# Altium schematic sheet Aixcel_Tiny_Recon_Board_Diagram.SchDoc
size A4; Organization: Altium Limited; Address1: L3, 12a Rodborough Rd; Address2: Frenchs Forest; Address3: NSW; Address4: Australia 2086; DocumentNumber: 01; Revision: 01; SheetNumber: 2; SheetTotal: 4
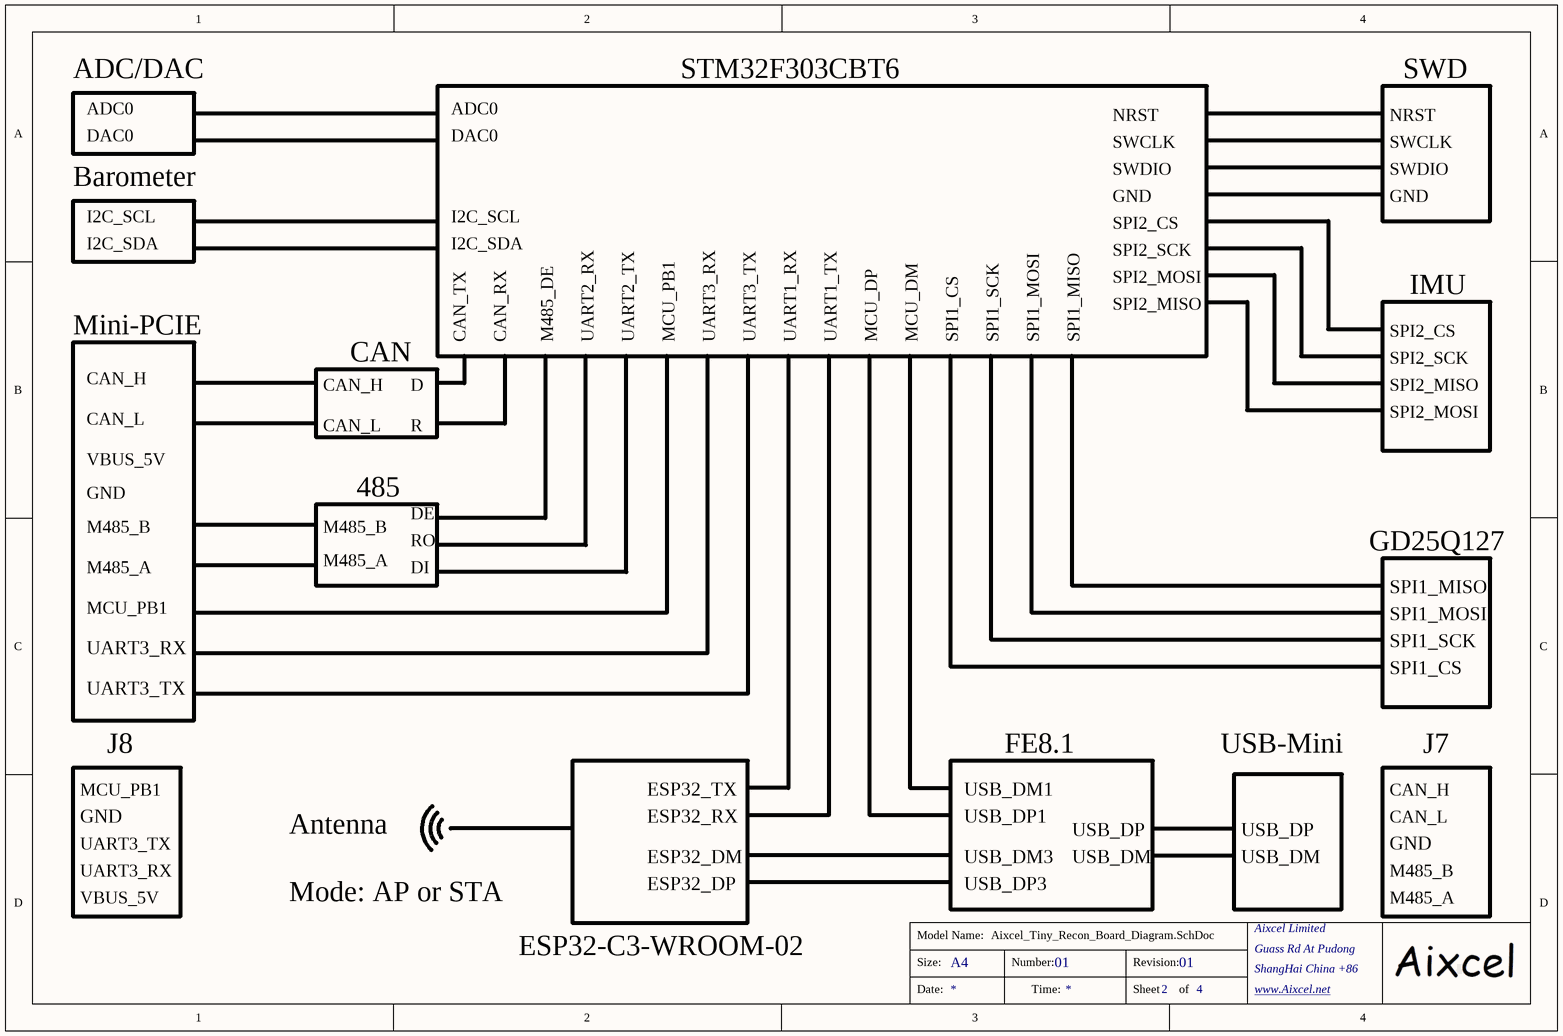
[diagram p0: Aixcel_Tiny_Recon_Board_Diagram.SchDoc]

## Notes on the sheet
- ADC/DAC
- ADC0
- STM32F303CBT6
- SWD
- DAC0
- NRST
- SWCLK
- SWDIO
- Barometer
- I2C_SCL
- I2C_SDA
- GND
- SPI2_CS
- SPI2_SCK
- SPI2_MOSI
- SPI2_MISO
- IMU
- Mini-PCIE
- CAN_H
- CAN
- CAN_TX
- CAN_RX
- M485_DE
- UART2_RX
- UART2_TX
- MCU_PB1
- UART3_RX
- UART3_TX
- UART1_RX
- UART1_TX
- MCU_DP
- MCU_DM
- SPI1_CS
- SPI1_SCK
- SPI1_MOSI
- SPI1_MISO
- CAN_L
- D
- R
- VBUS_5V
- 485
- DE
- M485_B
- M485_A
- RO
- DI
- GD25Q127
- J8
- FE8.1
- USB-Mini
- J7
- Antenna
- ESP32_RX
- ESP32_TX
- USB_DP1
- USB_DM1
- USB_DP
- Mode: AP or STA
- ESP32_DP
- ESP32_DM
- USB_DP3
- USB_DM3
- USB_DM
- ESP32-C3-WROOM-02
- Size:
- Model Name:
- A4
- Number:
- Revision:
- Aixcel Limited
- Guass Rd At Pudong
- ShangHai China +86
- Date:
- Time:
- Sheet
- of
- www.Aixcel.net <http://www.Aixcel.net>